# EAGLE board e_book_reader (EAGLE 9.7.0)
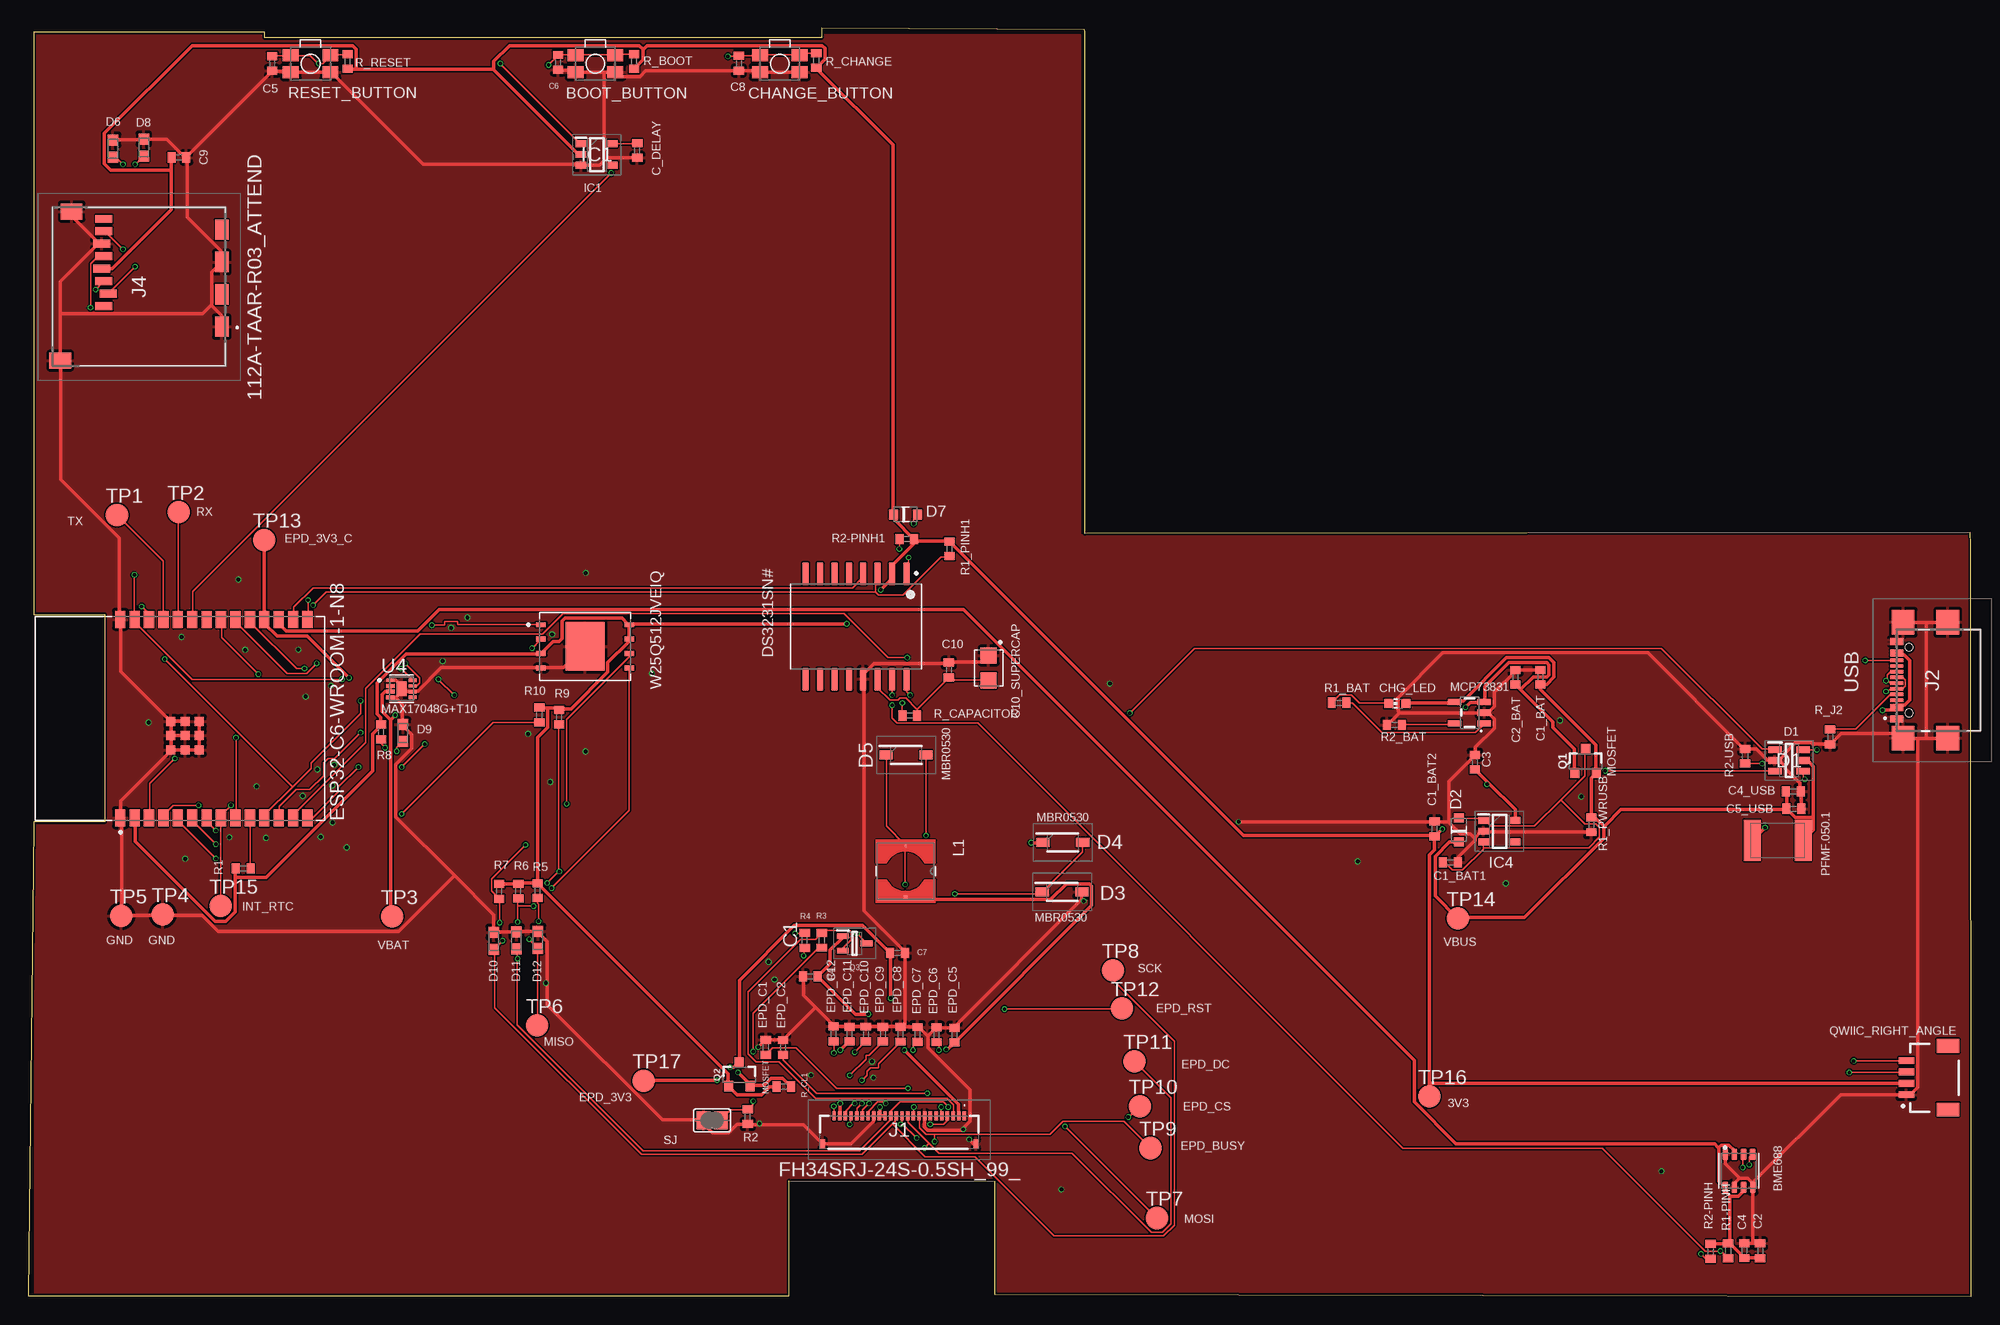
[diagram p1: board, top side]
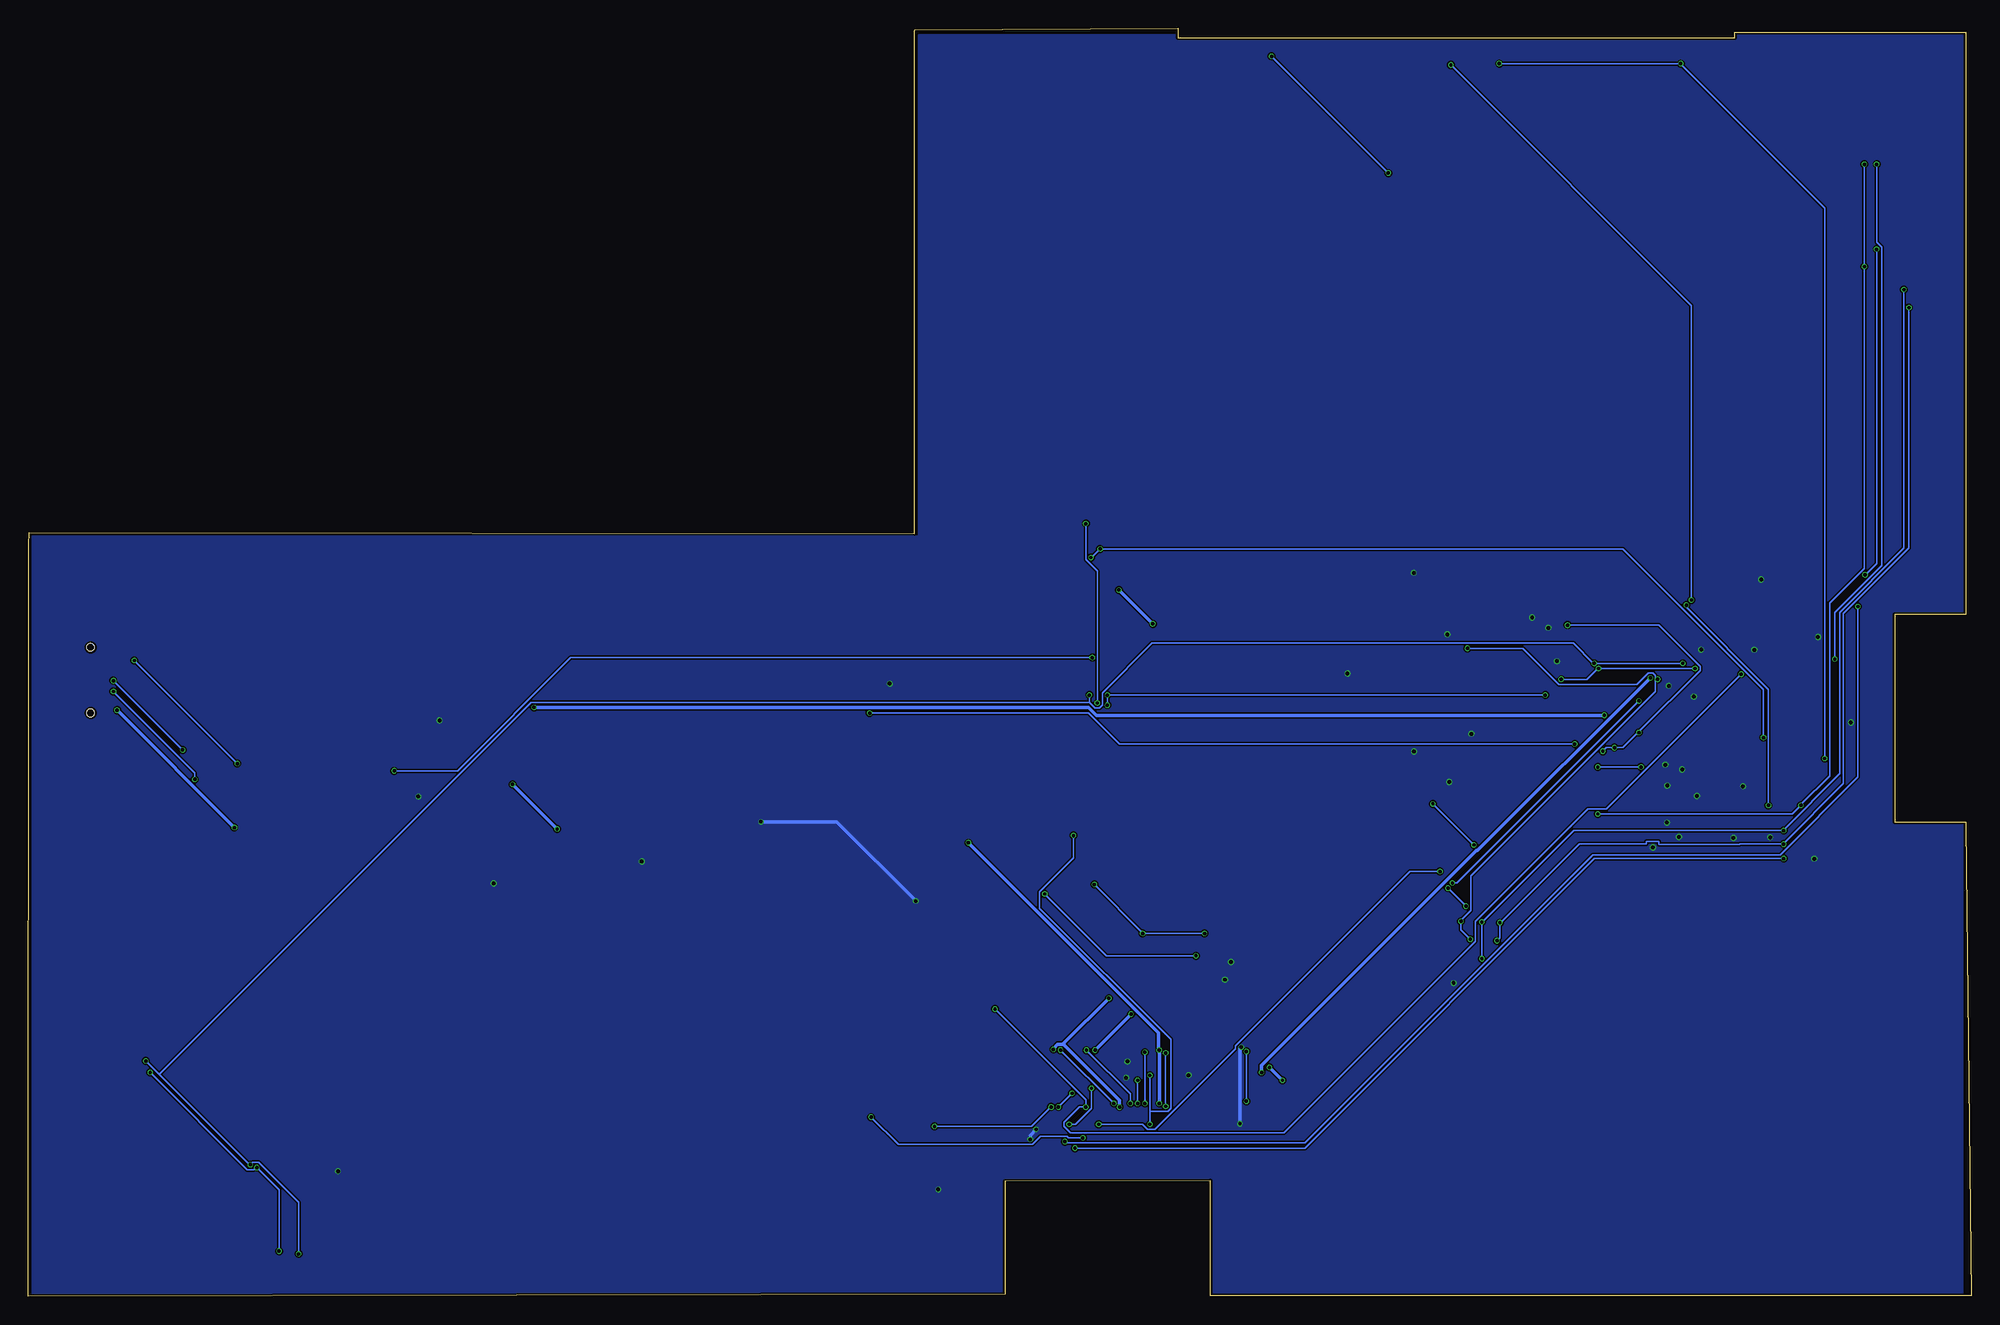
[diagram p2: board, bottom side, seen from below]

Size 171.29 x 111.79 mm. Coordinates in mm from the lower left corner, seen from the top.
Outline: 93.14,111.19 93.14,67.22 171.22,67.32 171.23,66.25 171.29,0 85.2,0.16 85.2,10.14 67.07,10.15 67.07,0.06 0,0.06 0.48,41.53 0.48,41.82 6.74,41.82 6.74,59.94 6.74,59.94 6.74,60.13 0.48,60.12 0.48,111.46 20.82,111.46 20.82,110.97 69.91,110.97 69.93,111.79 93.13,111.66 93.14,111.53 93.14,111.36 93.14,111.36 93.14,111.26 93.14,111.26 93.14,111.19
Outline: 93.14,111.19 93.14,111.19
Copper layers (1*16): Top 0.035mm / dielectric 1.6mm / Bottom 0.035mm
Design rules "jlcpcb-2layers.dru": minimum track width 5mil, minimum drill 0.3mm, track to track 5mil, track to pad 5mil, pad to pad 5mil, via to via 5mil, smd to smd 5mil, copper to edge 0.2mm, drill to drill 6mil, minimum pad ring 10mil, minimum via ring 3mil, stop-mask expansion 4mil, vias tented up to drill 0mil, thermal gap 10mil
Net classes: 1 power_0.3mm: width 0.3 mm; 2 0.15mm: width 0.15 mm

## Footprints (pad centres in the part's own frame; a part is rotated, then mirrored left to right if it is on the bottom)
ESP32_WROVER_EAGLE-LTSPICE_C0402 = smd 0.7 x 0.9: 1 -0.65,0; 2 0.65,0
EAGLE-LTSPICE_C0402 = smd 0.7 x 0.9: 1 -0.65,0; 2 0.65,0
CAPCP3225X100N = smd 1.4 x 1.4: 1 -1.1,0; 2 1.1,0
ADAFRUIT_CHIP-LED0603 = smd 0.8 x 0.8: A 0,-0.75; C 0,0.75
SOT95P280X145-6N = smd 1.2 x 0.6: 1 -1.25,0.95; 2 -1.25,0; 3 -1.25,-0.95; 4 1.25,-0.95; 5 1.25,0; 6 1.25,0.95
ESP32_WROVER_AVX---SD0805S020S1R0_AVX_SD0805S020S1R0_0 = smd 0.8 x 0.9: 1 -1.05,0; 2 1.05,0
SOD3716X135N = smd 1.15 x 0.8: 1 -1.75,0; 2 1.75,0
DIOC1608X36N = smd 0.97 x 0.94: 1 -0.75,0; 2 0.75,0
SOT95P280X125-5N = smd 0.9 x 0.6: 1 -1.4,0.95; 2 -1.4,0; 3 -1.4,-0.95; 4 1.4,-0.95; 5 1.4,0.95
SOT95P280X120-5N = smd 0.9 x 0.6: 1 -1.4,0.95; 2 -1.4,0; 3 -1.4,-0.95; 4 1.4,-0.95; 5 1.4,0.95
FH34SRJ24S05SH99 = smd 0.3 x 0.8: 1 5.75,1.45; 2 5.25,1.45; 3 4.75,1.45; 4 4.25,1.45; 5 3.75,1.45; 6 3.25,1.45; 7 2.75,1.45; 8 2.25,1.45; 9 1.75,1.45; 10 1.25,1.45; 11 0.75,1.45; 12 0.25,1.45; 13 -0.25,1.45; 14 -0.75,1.45; 15 -1.25,1.45; 16 -1.75,1.45; 17 -2.25,1.45; 18 -2.75,1.45; 19 -3.25,1.45; 20 -3.75,1.45; 21 -4.25,1.45; 22 -4.75,1.45; 23 -5.25,1.45; 24 -5.75,1.45 | smd 0.4 x 0.8: MP1 6.75,-1.05; MP2 -6.75,-1.05
SAMACSYS_PARTS_USB4110GFA = smd 0.3 x 1.15: A1 -3.556,3.678; A4 -2.55,3.678; A5 -1.25,3.678; A6 -0.25,3.678; A7 0.25,3.678; A8 1.25,3.678; A9 2.55,3.678; A12 3.556,3.678; B1 3.256,3.678; B4 2.25,3.678; B5 1.75,3.678; B6 0.75,3.678; B7 -0.75,3.678; B8 -1.75,3.678; B9 -2.25,3.678; B12 -3.256,3.678 | smd 2.18 x 2: MP1 -5.11,-0.827; MP2 5.11,-0.827; MP3 -5.11,3.103; MP4 5.11,3.103 | hole 0.65: -2.89,2.603; 2.89,2.603
JST04_1MM_RA = smd 0.6 x 1.35: 1 -1.5,0; 2 -0.5,0; 3 0.5,0; 4 1.5,0 | smd 1.2 x 2: NC1 2.8,-3.675; NC2 -2.8,-3.675
112ATAARR03ATTEND = smd 1.8 x 1.2: G1 10.6,10.4; G2 4.9,10.4; S1 7.75,10.4; S2 2.05,10.4 | smd 1.4 x 1.9: G3 13.6,-3.85; G4 0.45,-2.85 | smd 0.7 x 1.5: P1 8.8,0; P2 7.7,0.4; P3 6.6,0; P4 5.5,-0.2; P5 4.4,0; P6 3.3,-0.2; P7 2.2,0; P8 1.1,0
IND_4828-WE-TPC_WRE = smd 0.254 x 0.152: 1 -2.286,0 | smd 0.305 x 0.305: 2 2.286,0
ESP32_WROVER_SPARKFUN-IC-POWER_SOT23-5 = smd 0.55 x 1.2: 1 -0.95,-1.3; 2 0,-1.3; 3 0.95,-1.3; 4 0.95,1.3; 5 -0.95,1.3
ESP32C6_VARISTOR_CT/CN1812 = smd 1.5 x 3.6: 1 -2.25,0; 2 2.25,0
ESP32_WROVER_SPARKFUN-DISCRETESEMI_SOT23-3 = smd 0.8 x 0.9: 1 -0.95,-1; 2 0.95,-1; 3 0,1.1
SOT65P210X110-3N = smd 1.05 x 0.5: 1 -1.05,0.65; 2 -1.05,-0.65; 3 1.05,0
ESP32_WROVER_EAGLE-LTSPICE_R0402 = smd 0.7 x 0.9: 1 -0.65,0; 2 0.65,0
ESP32_WROVER_BME680_PSON80P300X300X100-8N = smd 1.016 x 0.5: 1 1.458,1.2; 2 1.458,0.4; 3 1.458,-0.4; 4 1.458,-1.2; 5 -1.458,-1.22; 6 -1.458,-0.4; 7 -1.458,0.4; 8 -1.458,1.2
SJ = smd 1.168 x 1.6: 1 -0.762,0; 2 0.762,0
TP20R = smd 2 x 2: TP 0,0
SON127P600X800X80-9N = smd 0.94 x 0.44: 1 -3.895,1.905; 2 -3.895,0.635; 3 -3.895,-0.635; 4 -3.895,-1.905; 5 3.895,-1.905; 6 3.895,-0.635; 7 3.895,0.635; 8 3.895,1.905 | smd 3.4 x 4.3: 9 0,0
XCVR_ESP32-C6-WROOM-1-N8 = smd 1.5 x 0.9: 1 -8.75,5.26; 2 -8.75,3.99; 3 -8.75,2.72; 4 -8.75,1.45; 5 -8.75,0.18; 6 -8.75,-1.09; 7 -8.75,-2.36; 8 -8.75,-3.63; 9 -8.75,-4.9; 10 -8.75,-6.17; 11 -8.75,-7.44; 12 -8.75,-8.71; 13 -8.75,-9.98; 14 -8.75,-11.25; 15 8.75,-11.25; 16 8.75,-9.98; 17 8.75,-8.71; 18 8.75,-7.44; 19 8.75,-6.17; 20 8.75,-4.9; 21 8.75,-3.63; 22 8.75,-2.36; 23 8.75,-1.09; 24 8.75,0.18; 25 8.75,1.45; 26 8.75,2.72; 27 8.75,3.99; 28 8.75,5.26 | smd 0.8 x 0.8: 29_1 -2.755,0.79; 29_2 -1.505,0.79; 29_3 -0.255,0.79; 29_4 -2.755,-0.46; 29_5 -1.505,-0.46; 29_6 -0.255,-0.46; 29_7 -2.755,-1.71; 29_8 -1.505,-1.71; 29_9 -0.255,-1.71
SOIC127P1032X265-16N = smd 2.05 x 0.59: 1 -4.655,4.445; 2 -4.655,3.175; 3 -4.655,1.905; 4 -4.655,0.635; 5 -4.655,-0.635; 6 -4.655,-1.905; 7 -4.655,-3.175; 8 -4.655,-4.445; 9 4.655,-4.445; 10 4.655,-3.175; 11 4.655,-1.905; 12 4.655,-0.635; 13 4.655,0.635; 14 4.655,1.905; 15 4.655,3.175; 16 4.655,4.445
SON50P200X200X80-9N = smd 0.76 x 0.321: 1 -0.985,0.75; 6 0.985,-0.25 | smd 0.813 x 0.401: 2 -0.985,0.25 | smd 0.813 x 0.356: 3 -0.985,-0.25; 4 -0.985,-0.75 | smd 0.76 x 0.27: 5 0.985,-0.75; 7 0.985,0.25; 8 0.985,0.75 | smd 0.9 x 1.3: 9 0,0
MYBUTTON = smd 1.4 x 1.05: 1 1.75,0.75; 2 -1.75,0.75; 3 -1.75,-0.75; 4 1.75,-0.75

## Placement (x,y rotation side)
C1  4.7uF/25V  [ESP32_WROVER_EAGLE-LTSPICE_C0402]  68.45,31.38 90 top
C1_BAT  4.7uF  [ESP32_WROVER_EAGLE-LTSPICE_C0402]  133.3,54.57 90 top
C1_BAT1  4.7uF  [ESP32_WROVER_EAGLE-LTSPICE_C0402]  125.36,38.24 0 top
C1_BAT2  4.7uF  [ESP32_WROVER_EAGLE-LTSPICE_C0402]  123.98,41.2 90 top
C2  100nF  [ESP32_WROVER_EAGLE-LTSPICE_C0402]  152.68,4 90 top
C2_BAT  4.7uF  [ESP32_WROVER_EAGLE-LTSPICE_C0402]  131.11,54.58 90 top
C3  100uF TANT  [ESP32_WROVER_EAGLE-LTSPICE_C0402]  127.53,47.08 90 top
C4  100nF  [ESP32_WROVER_EAGLE-LTSPICE_C0402]  151.3,4.01 90 top
C4_USB  100nF  [ESP32_WROVER_EAGLE-LTSPICE_C0402]  155.61,44.51 0 top
C5  1uF  [EAGLE-LTSPICE_C0402]  21.5,108.69 270 top
C5_USB  4.7uF  [ESP32_WROVER_EAGLE-LTSPICE_C0402]  155.65,42.98 0 top
C6  100nF  [EAGLE-LTSPICE_C0402]  46.69,108.79 270 top
C7  10uF  [ESP32_WROVER_EAGLE-LTSPICE_C0402]  76.64,30.26 0 top
C8  100nF  [ESP32_WROVER_EAGLE-LTSPICE_C0402]  62.64,108.71 270 top
C9  100nF  [ESP32_WROVER_EAGLE-LTSPICE_C0402]  13.28,100.41 0 top
C10  100nF  [ESP32_WROVER_EAGLE-LTSPICE_C0402]  81.15,55.22 90 top
C10_SUPERCAP  CPH3225A  [CAPCP3225X100N]  84.67,55.39 270 top
C_DELAY  100nF  [ESP32_WROVER_EAGLE-LTSPICE_C0402]  53.68,101.02 270 top
CHG_LED  [ADAFRUIT_CHIP-LED0603]  120.69,52.26 90 top
D1  USBLC6-2SC6Y  [SOT95P280X145-6N]  155.23,47.23 0 top
D2  ESP32_WROVER_AVX---SD0805S020S1R0_AVX_SD0805S020S1R0_0_0  [ESP32_WROVER_AVX---SD0805S020S1R0_AVX_SD0805S020S1R0_0]  126.13,41.11 90 top
D3  MBR0530  [SOD3716X135N]  91.14,35.65 0 top
D4  MBR0530  [SOD3716X135N]  91.21,40.01 0 top
D5  MBR0530  [SOD3716X135N]  77.38,47.71 0 top
D6  PGB1010603MR  [DIOC1608X36N]  7.46,101.19 90 top
D7  ESP32_WROVER_AVX---SD0805S020S1R0_AVX_SD0805S020S1R0_0_0  [ESP32_WROVER_AVX---SD0805S020S1R0_AVX_SD0805S020S1R0_0]  77.33,68.93 0 top
D8  PGB1010603MR  [DIOC1608X36N]  10.18,101.29 90 top
D9  PGB1010603MR  [DIOC1608X36N]  33.02,49.66 90 top
D10  PGB1010603MR  [DIOC1608X36N]  41.04,31.34 90 top
D11  PGB1010603MR  [DIOC1608X36N]  43.03,31.37 90 top
D12  PGB1010603MR  [DIOC1608X36N]  44.93,31.42 90 top
EPD_C1  1uF/50V  [ESP32_WROVER_EAGLE-LTSPICE_C0402]  65.02,21.94 90 top
EPD_C2  1uF/50V  [ESP32_WROVER_EAGLE-LTSPICE_C0402]  66.55,21.93 90 top
EPD_C5  0.1uF/50V  [ESP32_WROVER_EAGLE-LTSPICE_C0402]  81.65,23.01 90 top
EPD_C6  1uF/50V  [ESP32_WROVER_EAGLE-LTSPICE_C0402]  80.06,23.05 90 top
EPD_C7  1uF/50V  [ESP32_WROVER_EAGLE-LTSPICE_C0402]  78.4,23.07 90 top
EPD_C8  1uF/50V  [ESP32_WROVER_EAGLE-LTSPICE_C0402]  76.9,23.1 90 top
EPD_C9  1uF/50V  [ESP32_WROVER_EAGLE-LTSPICE_C0402]  75.33,23.1 90 top
EPD_C10  1uF/50V  [ESP32_WROVER_EAGLE-LTSPICE_C0402]  73.84,23.11 90 top
EPD_C11  1uF/50V  [ESP32_WROVER_EAGLE-LTSPICE_C0402]  72.39,23.11 90 top
EPD_C12  1uF/50V  [ESP32_WROVER_EAGLE-LTSPICE_C0402]  70.99,23.12 90 top
IC1  BD5229G-TR  [SOT95P280X125-5N]  50.11,100.66 0 top
IC4  XC6220A331MR-G  [SOT95P280X120-5N]  129.7,40.99 0 top
J1  FH34SRJ-24S-0.5SH_99_  [FH34SRJ24S05SH99]  76.78,14.46 0 top
J2  SAMACSYS_PARTS_USB4110-GF-A  [SAMACSYS_PARTS_USB4110GFA]  168.39,54.31 90 top
J3  QWIIC_RIGHT_ANGLE  [JST04_1MM_RA]  165.58,19.27 90 top
J4  112A-TAAR-R03_ATTEND  [112ATAARR03ATTEND]  6.66,96.09 270 top
L1  68uH  [IND_4828-WE-TPC_WRE]  77.35,37.47 270 top
MCP73831  ESP32_WROVER_SPARKFUN-IC-POWER_MCP73831  [ESP32_WROVER_SPARKFUN-IC-POWER_SOT23-5]  127.06,51.45 90 top
PFMF.050.1  ESP32C6_VARISTORCN1812  [ESP32C6_VARISTOR_CT/CN1812]  154.23,40.19 0 top
Q1  ESP32_WROVER_SPARKFUN-DISCRETESEMI_MOSFET_PCH  [ESP32_WROVER_SPARKFUN-DISCRETESEMI_SOT23-3]  137.29,47.14 0 top
Q2  ESP32_WROVER_SPARKFUN-DISCRETESEMI_MOSFET_PCH  [ESP32_WROVER_SPARKFUN-DISCRETESEMI_SOT23-3]  62.68,19.52 0 top
Q3  SI1308EDL-T1-GE3  [SOT65P210X110-3N]  72.85,31.11 0 top
R1  10k  [ESP32_WROVER_EAGLE-LTSPICE_R0402]  18.94,37.7 0 top
R1-PINH  10K  [ESP32_WROVER_EAGLE-LTSPICE_R0402]  149.86,4 90 top
R1_BAT  200  [ESP32_WROVER_EAGLE-LTSPICE_R0402]  115.56,52.32 0 top
R1_PINH1  10K  [ESP32_WROVER_EAGLE-LTSPICE_R0402]  81.21,65.9 90 top
R1_PWRUSB  100k  [ESP32_WROVER_EAGLE-LTSPICE_R0402]  137.8,41.56 90 top
R2  2.2  [ESP32_WROVER_EAGLE-LTSPICE_R0402]  63.42,15.83 90 top
R2-PINH  10K  [ESP32_WROVER_EAGLE-LTSPICE_R0402]  148.31,3.95 90 top
R2-PINH1  10K  [ESP32_WROVER_EAGLE-LTSPICE_R0402]  77.44,66.75 0 top
R2-USB  5k1  [ESP32_WROVER_EAGLE-LTSPICE_R0402]  151.35,47.62 90 top
R2_BAT  2k  [ESP32_WROVER_EAGLE-LTSPICE_R0402]  120.44,50.38 0 top
R3  0.47  [ESP32_WROVER_EAGLE-LTSPICE_R0402]  69.95,31.38 90 top
R4  10K  [ESP32_WROVER_EAGLE-LTSPICE_R0402]  68.93,28.21 0 top
R5  10K  [ESP32_WROVER_EAGLE-LTSPICE_R0402]  44.9,35.75 90 top
R6  10K  [ESP32_WROVER_EAGLE-LTSPICE_R0402]  43.19,35.71 90 top
R7  10K  [ESP32_WROVER_EAGLE-LTSPICE_R0402]  41.5,35.7 90 top
R8  10K  [ESP32_WROVER_EAGLE-LTSPICE_R0402]  31.1,49.75 90 top
R9  10K  [ESP32_WROVER_EAGLE-LTSPICE_R0402]  46.79,51.04 90 top
R10  10K  [ESP32_WROVER_EAGLE-LTSPICE_R0402]  45.05,51.24 90 top
R_BOOT  10K  [ESP32_WROVER_EAGLE-LTSPICE_R0402]  53.39,108.88 270 top
R_CAPACITOR  15  [ESP32_WROVER_EAGLE-LTSPICE_R0402]  77.7,51.19 0 top
R_CHANGE  10K  [ESP32_WROVER_EAGLE-LTSPICE_R0402]  69.47,108.95 270 top
R_CL1  10K  [ESP32_WROVER_EAGLE-LTSPICE_R0402]  66.61,18.48 180 top
R_J2  5k1  [ESP32_WROVER_EAGLE-LTSPICE_R0402]  158.85,49.31 90 top
R_RESET  10K  [ESP32_WROVER_EAGLE-LTSPICE_R0402]  28.14,108.86 270 top
SENSOR2  BME688  [ESP32_WROVER_BME680_PSON80P300X300X100-8N]  150.81,11.06 90 top
SJ1  [SJ]  60.28,15.49 0 top
TP1  TPTP20R  [TP20R]  7.81,68.88 0 top
TP2  TPTP20R  [TP20R]  13.24,69.12 0 top
TP3  TPTP20R  [TP20R]  32.06,33.47 0 top
TP4  TPTP20R  [TP20R]  11.86,33.65 0 top
TP5  TPTP20R  [TP20R]  8.17,33.53 0 top
TP6  TPTP20R  [TP20R]  44.85,23.86 0 top
TP7  TPTP20R  [TP20R]  99.52,6.89 0 top
TP8  TPTP20R  [TP20R]  95.63,28.73 0 top
TP9  TPTP20R  [TP20R]  98.93,13.06 0 top
TP10  TPTP20R  [TP20R]  98,16.75 0 top
TP11  TPTP20R  [TP20R]  97.52,20.71 0 top
TP12  TPTP20R  [TP20R]  96.41,25.37 0 top
TP13  TPTP20R  [TP20R]  20.77,66.69 0 top
TP14  TPTP20R  [TP20R]  126.02,33.3 0 top
TP15  TPTP20R  [TP20R]  16.94,34.39 0 top
TP16  TPTP20R  [TP20R]  123.51,17.61 0 top
TP17  TP  [TP20R]  54.24,19 0 top
U1  W25Q512JVEIQ  [SON127P600X800X80-9N]  49.09,57.3 0 top
U2  ESP32-C6-WROOM-1-N8  [XCVR_ESP32-C6-WROOM-1-N8]  13.36,50.93 90 top
U3  DS3231SN#  [SOIC127P1032X265-16N]  72.97,59.05 270 top
U4  MAX17048G+T10  [SON50P200X200X80-9N]  32.9,53.55 0 top
U$1  RESET_BUTTON  [MYBUTTON]  24.88,108.68 180 top
U$2  BOOT_BUTTON  [MYBUTTON]  49.99,108.68 180 top
U$3  CHANGE_BUTTON  [MYBUTTON]  66.25,108.68 180 top

## Tracks (layer width: path | path; a pad name or v marks a point on that pad's centre or on a via)
3V3  (via drill 0.3)
  Top 0.3: 18.24,36.93 18.24,33.89 17.42,33.06 16.46,33.06 9.42,40.11 9.42,42.14 U2.2 | 18.24,36.93 18.24,37.69 R1.1 | 18.24,36.93 20.97,36.93 30.37,46.33 30.37,49.57 31.07,50.27 R8.2 31.07,50.46 31.07,51.03 30.75,51.35 30.75,54.08 33.29,56.62 45.17,56.62 U1.3 46.25,57.72 46.81,57.72 47.07,57.99 47.07,59.54 47.33,59.79 52.34,59.79 52.85,59.29 U1.8 | R_CL1.2 65.93,18.45 65.36,18.45 64.66,17.76 62.5,17.76 61.74,18.52 Q2.1 61.68,18.65 61.68,19.6 44.98,36.3 R5.2 | R7.2 41.55,36.36 43.13,36.36 R6.2 43.32,36.42 44.85,36.42 R5.2 | U1.8 52.98,59.16 U1.7 52.91,57.82 52.91,57.7 51.07,55.86 51.07,55.03 47.83,51.79 46.88,51.79 R9.2 46.75,51.73 46.63,51.86 45.8,51.86 | 45.8,51.86 45.1,51.86 R10.2 | 45.8,51.86 45.8,50.14 44.91,49.25 44.91,36.55 R5.2 | 128.76,45.22 127.59,46.39 C3.1 | 128.76,45.22 131.08,42.9 131.08,41.95 IC4.5 | 123.53,18.77 123.53,17.63 TP16.TP | 123.53,18.77 123.53,38.9 123.97,39.35 123.97,40.49 C1_BAT2.1 | 123.53,18.77 165.56,18.77 J3.2 | v128.61,45.12 128.67,45.12 128.76,45.22 | v124.67,41.19 124.1,40.62 C1_BAT2.1 | 12.59,99.29 12.59,95.8 7.38,90.59 6.5,90.59 J4.P4 | 12.59,99.29 12.59,100.37 C9.1 | R2-PINH1.2 78.06,66.78 76.34,68.49 76.34,68.87 D7.1 76.22,69.06 76.22,101.51 69.55,108.18 R_CHANGE.2 69.49,108.31 70.25,109.07 70.25,110.02 69.99,110.28 54.56,110.28 54.31,110.02 54.18,109.96 | R2-PINH1.2 78.19,66.65 78.25,66.59 81.17,66.59 R1_PINH1.2 81.3,66.46 107.14,40.62 123.84,40.62 C1_BAT2.1 | R2-PINH1.2 78.19,66.46 76.15,64.43 76.15,63.73 U3.2 76.09,63.6 76.09,63.22 v75.14,62.27 | 40.98,108.18 28.91,108.18 | 28.91,108.18 28.15,108.18 R_RESET.2
  Top 0.3: 40.98,108.18 48.47,100.69 48.66,100.69 IC1.2 | 54.18,109.96 54.18,109.01 53.42,108.24 R_BOOT.2 | 54.18,109.96 53.87,110.28 42.44,110.28 41.04,108.88 41.04,108.31 40.98,108.18 | 12.59,99.29 7.26,99.29 6.69,99.86 6.69,102.53 14.43,110.28 28.59,110.28 28.91,109.96 28.91,108.18 | v72.15,59.29 53.1,59.29 U1.8
  Bottom 0.3: v124.67,41.19 v128.61,45.12 | v75.14,62.27 v72.15,59.29
32KHZ  (via drill 0.3)
  Top 0.15: v76.79,65.89 76.79,66.71 R2-PINH1.1 | v77.62,65.13 77.62,63.92 77.42,63.73 U3.1 | v18.31,49.25 18.31,42.2 U2.9
  Bottom 0.15: v77.62,65.13 77.55,65.13 v76.79,65.89 30.69,65.89 18.31,53.51 v18.31,49.25
DN  (via drill 0.3)
  Top 0.15: J2.A7 164.74,54.52 165.31,54.52 165.5,54.33 165.5,53.82 165.24,53.57 164.74,53.57 J2.B7 164.67,53.51 164.1,53.51 163.91,53.32 v163.78,53.32 | v156.61,45.57 156.48,45.7 156.48,46.27 D1.4
  Bottom 0.15: v156.61,45.57 156.61,46.14 v163.78,53.32
DP  (via drill 0.3)
  Top 0.15: 163.91,54.33 164.17,54.08 164.67,54.08 J2.A6 | 163.91,54.33 163.91,54.78 164.17,55.03 164.67,55.03 J2.B6 | v157.69,48.17 D1.6 | v163.78,54.27 163.85,54.33 163.91,54.33
  Bottom 0.15: v163.78,54.27 v157.69,48.17
EPD_3V3  (via drill 0.3)
  Top 0.3: v60.72,19.03 54.25,19.03 TP17.TP | v61.87,20.17 62.18,20.17 62.57,20.55 Q2.3 62.69,20.68 62.69,27.85 67.52,32.68 73.55,32.68 75.96,30.27 C7.1 76.03,30.14 v76.03,26.26 | J1.15 75.52,15.91 75.07,15.91 J1.16 75.07,16.04 v75.07,16.68 | L1.2 77.36,35.15 77.55,34.96 90.12,34.96 91.52,36.36 93.55,36.36 93.74,36.17 93.74,34.46 81.68,22.39 EPD_C5.1 81.55,22.26 81.04,21.76 v80.92,21.76
  Bottom 0.3: v61.87,20.17 v60.72,19.03 | v75.07,16.68 75.07,17.25 80.03,22.2 | 80.03,22.2 80.54,22.2 80.92,21.82 v80.92,21.76 | v76.03,26.26 79.96,22.33 80.03,22.2
EPD_3V3_C  (via drill 0.3)
  Top 0.3: R_CL1.1 67.2,18.52 66.5,19.22 65.49,19.22 64.85,18.58 63.64,18.58 Q2.2 63.58,18.71 v62.57,19.72 | TP13.TP 20.78,66.65 20.78,59.73 U2.18 20.85,59.54 20.85,59.29 21.93,58.21 24.59,58.21 v28.28,54.52
  Bottom 0.3: v62.57,19.72 62.57,20.36 43.64,39.28 43.52,39.28 v28.28,54.52
EPD_BUSY  (via drill 0.3)
  Top 0.15: 79.9,14.26 90.06,14.26 91.2,15.41 96.6,15.41 98.89,13.12 TP9.TP | 79.9,14.26 79.14,14.26 78.57,14.84 78.57,15.85 J1.9 | v9.99,60.81 10.62,60.17 10.62,59.73 U2.26 | 79.9,14.26 v79.9,13.63
  Bottom 0.15: v9.99,60.81 9.99,45.76 16.85,38.9 33.36,38.9 58.76,13.5 79.77,13.5 v79.9,13.63
EPD_CS  (via drill 0.3)
  Top 0.15: 77.04,15.22 77.04,15.85 J1.12 | v78.31,13.95 77.04,15.22 | v96.98,15.79 97.93,16.74 TP10.TP | 46.75,37.44 46.75,50.33 R9.1 | v45.74,36.42 46.75,37.44 | 23.29,44.9 20.85,42.46 20.85,42.2 U2.11 | v8.34,99.8 7.7,100.43 7.51,100.43 D6.1 | 23.29,44.9 v12.02,56.17 | v76.92,15.15 76.98,15.22 77.04,15.22 | v46.82,37.44 46.75,37.44 | 23.29,44.9 24.92,46.53 24.92,46.99 29.29,51.36 v29.29,52.49
  Bottom 0.15: v78.31,13.95 79.58,13.95 79.71,14.07 82.06,14.07 82.76,13.37 94.57,13.37 v96.98,15.79 | v45.74,36.42 45.36,36.42 v29.29,52.49 | v8.34,99.8 8.34,92.94 7.89,92.5 7.89,64.43 12.02,60.3 v12.02,56.17 | v76.92,15.15 73.04,15.15 72.6,14.71 71.96,14.71 64.85,21.82 64.85,22.07 49.48,37.44 v46.82,37.44
EPD_DC  (via drill 0.3)
  Top 0.15: 79.42,13.47 80.28,12.61 92.03,12.61 99.01,5.63 99.97,5.63 100.73,6.39 100.73,17.5 97.55,20.68 TP11.TP | 79.42,13.47 77.55,15.34 77.55,15.85 J1.11 | v16.53,38.58 13.23,41.89 13.23,42.14 U2.5 | 79.42,13.47 v79.01,13.06
  Bottom 0.15: v16.53,38.58 33.23,38.58 58.76,13.06 v79.01,13.06
EPD_RST  (via drill 0.3)
  Top 0.15: v78.06,16.68 78.06,15.91 J1.10 | v86.06,25.31 96.41,25.31 TP12.TP | v20.27,54.84 17.04,58.08 17.04,59.67 U2.21
  Bottom 0.15: v86.06,25.31 78.06,17.31 v78.06,16.68 78.63,16.68 79.96,15.34 79.96,14.96 79.39,14.39 60.6,14.39 43.71,31.28 43.71,33.06 33.8,42.97 32.15,42.97 v20.27,54.84
FLASH_CS  (via drill 0.3)
  Top 0.15: v31.45,48.36 31.13,48.68 31.13,49.06 R8.1 | v32.47,48.05 32.47,48.36 32.97,48.87 D9.1 | U2.12 22.12,42.2 22.12,43.16 23.62,44.67 24.81,44.67 26.03,45.89 26.03,47.04 26.41,47.41 27.01,47.41 v29.29,49.7 | v35.58,59.16 36.72,59.16 36.72,59.49 37.83,59.49 37.83,59.21 U1.1
  Bottom 0.15: v32.47,48.05 32.15,48.36 v31.45,48.36 30.69,48.36 29.32,49.73 | v35.58,59.16 27.51,59.16 23.89,55.54 23.89,55.16 29.32,49.73 | v29.29,49.7 29.32,49.73
GDR  (via drill 0.3)
  Top 0.3: v77.23,21.69 82,16.93 82,15.91 J1.2 | v74.06,24.87 72.92,24.87 69.61,28.17 R4.2 69.68,28.3 70.69,29.31 70.69,30.52 71.77,31.6 71.77,31.73 Q3.1
  Bottom 0.3: v74.06,24.87 v77.23,21.69
GND  (via drill 0.3, 0.35)
  Top 0.3: U2.29_1 12.59,48.17 12.59,49.38 U2.29_2 | U2.29_1 12.72,48.17 13.8,48.17 U2.29_4 13.92,48.17 U2.29_7 15.07,48.3 15.07,49.38 U2.29_8 15.07,49.57 15.07,50.65 U2.29_9 | U2.29_3 12.59,50.65 12.59,49.57 U2.29_2 | U2.29_5 13.8,49.44 12.72,49.44 U2.29_2 | U2.29_6 13.8,50.71 12.72,50.71 U2.29_3 | U2.29_1 12.53,48.05 8.15,43.66 8.15,42.2 U2.1 8.21,42.08 8.21,33.69 TP5.TP 8.21,33.57 11.77,33.57 11.83,33.63 TP4.TP 11.96,33.57 15.32,33.57 16.72,32.17 32.66,32.17 37.58,37.09 | U2.29_3 12.46,50.78 8.15,55.09 8.15,59.67 U2.28 8.02,59.79 8.02,66.84 2.88,71.98 2.88,82.4 J4.G3 2.81,82.53 2.81,86.65 | U$3.2 67.96,107.93 64.6,107.93 U$3.1 64.47,107.99 64.41,108.05 62.69,108.05 C8.2 62.5,108.05 54.44,108.05 53.93,107.55 52.15,107.55 51.83,107.86 U$2.2 51.71,107.93 50.75,107.93 | 51.01,100.37 50.37,99.73 48.72,99.73 IC1.3 48.6,99.8 34.82,99.8 26.75,107.86 U$1.2 23.26,107.93 U$1.1 23.13,107.99 21.54,107.99 C5.2 21.42,107.93 13.99,100.5 C9.2 | 51.01,100.37 C_DELAY.2 | C6.2 46.75,108.12 48.09,108.12 48.21,107.99 U$2.1 48.34,107.93 50.75,107.93 | 50.75,107.93 50.75,101.2 50.95,101 50.95,100.5 51.01,100.37 | J4.G4 3.83,95.61 3.83,95.23 6.24,92.81 6.43,92.81 J4.P6 6.11,92.75 2.81,89.45 2.81,86.65 | 16.15,87.35 17.04,86.46 17.04,85.51 J4.G1 | 16.15,87.35 16.15,90.27 17.04,91.16 J4.G2 16.97,91.29 16.97,92.18 13.99,95.16 13.99,100.31 C9.2 | C9.2 13.92,100.43 13.8,100.43 12.21,102.02 10.24,102.02 D8.2 10.11,101.96 7.51,101.96 D6.2 | 2.81,86.65 15.38,86.65 16.02,87.29 16.15,87.35 | 127.53,40.43 127.53,40.17 126.07,38.71 126.07,38.27 C1_BAT1.2 | 127.53,40.43 128.03,40.93 128.29,40.93 IC4.2 128.42,40.93 137.75,40.93 R1_PWRUSB.1
  Top 0.3: 125.18,41.82 124.03,41.82 C1_BAT2.2 123.84,41.82 v106.7,41.82 | 125.18,41.82 126.26,40.74 127.15,40.74 127.4,40.49 127.53,40.43 | C1_BAT.2 133.24,55.22 131.15,55.22 C2_BAT.2 131.08,55.09 129.24,53.25 129.24,51.98 128.8,51.54 MCP73831.2 | MCP73831.2 128.42,51.41 128.73,51.41 129.24,50.9 129.24,50.08 127.59,48.43 127.59,47.79 C3.2 127.46,47.6 125.24,45.38 125.24,41.95 125.18,41.82 | 120.86,51.41 119.84,50.4 R2_BAT.1 | 120.86,51.41 128.22,51.41 MCP73831.2 | 152.04,4.67 152.67,4.67 C2.2 | 152.04,4.67 151.34,4.67 C4.2 | 150.83,10.39 150.45,10.01 150.45,9.63 SENSOR2.7 | 150.83,10.39 151.59,10.39 151.97,10.01 151.97,9.63 SENSOR2.5 | SENSOR2.1 149.62,12.49 149.62,11.66 150.77,10.52 150.83,10.39 | SENSOR2.5 152.1,10.07 159.78,17.76 165.56,17.76 J3.1 165.69,17.82 166.01,17.82 166.58,18.39 166.58,49.19 | 152.04,4.67 152.04,9.5 SENSOR2.5 | J2.B1 164.74,57.57 164.74,57.82 J2.A12 164.74,58.01 164.74,58.9 165.24,59.41 J2.MP4 165.44,59.41 167.34,59.41 | 167.34,59.41 169.18,59.41 J2.MP2 | J2.B12 164.74,51.03 164.74,50.78 J2.A1 164.8,50.65 164.8,49.7 165.24,49.25 J2.MP3 | 166.58,49.19 165.44,49.19 J2.MP3 | 166.58,49.19 167.34,49.19 | 167.34,49.19 169.18,49.19 J2.MP1 | C5_USB.2 156.29,43.03 156.29,44.49 C4_USB.2 156.16,44.62 156.16,45.25 154.89,46.52 154.89,46.71 154.45,47.16 D1.2 | D1.2 153.94,47.28 153.31,47.28 152.35,48.24 151.4,48.24 R2-USB.2 151.21,48.3 142.77,56.75 124.73,56.75 120.73,52.74 120.73,51.73 120.79,51.66 120.79,51.54 120.86,51.41 | D1.2 154.13,47.28 154.39,47.28 154.89,47.79 154.89,47.92 155.78,48.81 157.18,48.81 157.31,48.68 158.83,48.68 R_J2.1 158.96,48.74 159.85,49.63 164.67,49.63 J2.MP3
  Top 0.3: 167.34,49.19 167.34,59.41 | 69.39,25.47 70.95,23.92 EPD_C12.2 71.01,23.79 72.34,23.79 EPD_C11.2 72.54,23.79 73.81,23.79 EPD_C10.2 73.93,23.79 75.33,23.79 EPD_C9.2 75.46,23.79 76.79,23.79 EPD_C8.2 | 69.39,25.47 68.34,26.52 68.34,28.17 R4.1 | 69.39,25.47 66.63,22.71 EPD_C2.2 66.5,22.58 65.04,22.58 EPD_C1.2 64.92,22.52 v64.34,21.95 | C10_SUPERCAP.1 84.09,55.92 81.17,55.92 C10.2 81.04,55.79 74.57,55.79 73.61,54.84 73.61,54.46 U3.13 73.68,54.27 73.68,33.95 77.23,30.39 C7.2 77.3,30.2 77.3,23.85 EPD_C8.2 | 82.38,14.77 83.01,15.41 83.01,18.2 79.33,21.88 79.33,22.96 | 82.38,14.77 82.25,14.64 79.27,14.64 79.01,14.9 79.01,15.85 J1.8 | 79.33,22.96 80.03,23.66 EPD_C6.2 80.15,23.66 81.62,23.66 EPD_C5.2 81.68,23.79 92.85,34.96 | v82.95,13.82 83.33,13.44 83.52,13.44 J1.MP1 | v82.44,14.71 82.38,14.77 | 79.33,22.96 79.2,23.03 78.57,23.66 78.44,23.66 EPD_C7.2 78.25,23.73 76.92,23.73 EPD_C8.2 | 92.85,34.96 92.85,35.6 D3.2 | J1.17 74.5,15.85 74.5,15.41 72.54,13.44 70.06,13.44 J1.MP2 69.93,13.5 68.34,15.09 64.47,15.09 | 64.47,15.09 63.52,15.09 R2.1 63.39,15.15 62.5,15.15 61.74,14.39 60.34,14.39 59.52,15.22 59.52,15.47 SJ1.1 59.39,15.53 55.9,15.53 45.74,25.69 45.74,31.28 44.98,32.04 D12.2 43.13,32.17 D11.2 43.01,32.11 41.1,32.11 D10.2 41.04,32.23 41.04,33.63 37.58,37.09 | U1.9 49.04,57.25 47.2,55.41 45.23,55.41 U1.4 45.04,55.41 36.4,55.41 34.37,53.38 33.99,53.38 U4.6 33.86,53.32 33.23,53.32 33.04,53.51 U4.9 | U4.1 31.96,54.33 32.4,54.33 32.85,53.89 32.85,53.57 U4.9 | 32.4,52.81 31.96,52.81 U4.4 | 32.4,52.81 32.97,53.38 U4.9 | 32.4,52.81 32.47,52.68 32.97,52.17 32.97,50.46 D9.2 33.04,50.27 33.8,49.51 33.8,48.3 32.4,46.9 32.4,42.27 37.58,37.09
  Top 0.3: v64.47,15.22 64.47,15.09 | v93.05,34.84 92.98,34.9 92.85,34.96
  Bottom 0.3: v82.95,13.82 82.95,14.2 v82.44,14.71 | v64.34,21.95 64.47,21.82 v64.47,15.22 | v106.7,41.82 100.03,41.82 v93.05,34.84
  other vias: 49.15,63.78 95.35,54.01 49.11,48.03 44.07,49.59 24.46,52.86 54.98,54.9 10.59,50.58 13.5,58.12 25.77,40.49 26.81,41.75 36.52,55.99 26.66,53.82 74.39,20.69 45.63,27.61 28.07,39.56 117.21,38.33 130.26,36.4 143.99,11.03 136.91,44.05 135.04,50.76 20.12,44.96 13.83,38.57 18.52,63.19 19.13,56.99 23.8,57.01 38.71,59.84 46.18,58.35 91.07,9.41 68.99,19.48 74.5,19.27 65.78,27.91 65.26,29.47 46.02,45.35 37.28,58.93 26.78,45.01 24.18,44.11 25.48,46.44 26.97,46.86 20.95,40.4 17.72,40.46
  pour Top: 67.02,10.23 67.04,10.24 85.21,10.24 85.24,10.23 85.26,10.21 85.27,10.18 85.27,0.08 171.21,0.08 171.21,67.13 92.84,67.13 92.81,67.14 92.79,67.16 92.78,67.19 92.78,111.22 0.62,111.22 0.6,111.22 0.6,111.22 0.6,111.22 0.59,111.22 0.56,111.22 0.56,60.2 6.75,60.2 6.78,60.19 6.8,60.17 6.81,60.14 6.81,41.81 6.8,41.78 6.78,41.76 6.75,41.75 0.56,41.75 0.56,0.14 66.98,0.14 66.98,10.18 66.99,10.21
  pour Bottom: 67,10.25 67.03,10.26 85.26,10.26 85.29,10.25 85.31,10.22 85.32,10.2 85.32,10.17 85.31,10.14 85.31,0.07 170.95,0.07 170.95,67 92.85,67 92.82,67.01 92.8,67.03 92.79,67.06 92.79,111.24 0.69,111.24 0.67,111.24 0.67,111.24 0.67,111.24 0.67,111.24 0.56,111.24 0.56,60.18 6.75,60.18 6.78,60.17 6.8,60.15 6.81,60.12 6.81,41.81 6.8,41.78 6.78,41.76 6.75,41.75 0.75,41.75 0.75,0.13 66.97,0.13 66.97,10.2 66.98,10.22
GPIO8
  Top 0.15: R1.2 19.58,37.76 19.58,42.14 U2.10
I2C_PW
  Top 0.3: C2.1 152.67,3.4 151.34,3.4 C4.1 151.21,3.47 150,4.67 R1-PINH.2 | R2-PINH.2 148.35,4.61 149.81,4.61 R1-PINH.2 | 150.07,8.8 149.62,9.25 149.62,9.56 SENSOR2.8 149.5,9.69 149.05,10.14 149.05,13.12 | 150.07,8.8 150.77,8.8 151.15,9.18 151.15,9.56 SENSOR2.6 | 149.05,13.12 149.24,13.31 149.94,13.31 150.39,12.87 150.39,12.55 SENSOR2.2 | U2.17 22.12,59.67 22.12,59.29 22.75,58.65 34.31,58.65 36.21,60.55 82.44,60.55 122.19,20.8 122.19,17.12 125.87,13.44 148.67,13.44 148.93,13.18 149.05,13.12 | R1-PINH.2 150,4.8 150,8.68 150.07,8.8
INT_RTC  (via drill 0.3)
  Top 0.15: 74.69,62.08 74.95,61.83 77.11,61.83 80.47,65.19 81.17,65.19 R1_PINH1.1 | 74.69,62.08 74.69,63.54 74.82,63.67 U3.3 | TP15.TP 16.97,34.46 16.97,42.14 U2.8 17.04,42.2 17.04,42.46 v17.86,43.28 | 74.69,62.08 26.24,62.08 v25.1,60.94
  Bottom 0.15: v25.1,60.94 25.1,60.75 17.86,53.51 v17.86,43.28
IO/BOOT  (via drill 0.3)
  Top 0.15: R_BOOT.1 53.36,109.51 51.83,109.51 51.77,109.45 U$2.3 51.71,109.45 48.28,109.45 U$2.4 48.21,109.45 46.75,109.45 C6.1 46.69,109.39 v45.87,108.56 | v24.66,61.38 24.66,59.73 U2.15
  Bottom 0.15: v24.66,61.38 24.66,87.35 v45.87,108.56
IO/CHANGE  (via drill 0.3)
  Top 0.15: R_CHANGE.1 69.42,109.58 68.15,109.58 68.03,109.45 U$3.3 67.96,109.45 64.53,109.45 U$3.4 64.47,109.39 62.69,109.39 C8.1 62.63,109.32 v61.68,109.32 | v51.39,99.04 14.5,62.14 14.5,59.73 U2.23
  Bottom 0.15: v61.68,109.32 v51.39,99.04
MISO  (via drill 0.3)
  Top 0.15: v44.98,33.06 44.98,34.58 44.91,34.65 44.91,35.09 R5.1 | v44.15,31.47 44.91,30.71 D12.1 44.91,30.65 44.91,23.92 TP6.TP | v44.4,57.13 45.17,57.89 U1.2 | v27.64,54.4 14.43,54.4 9.42,59.41 9.42,59.67 U2.27 9.35,59.73 v9.35,63.6 | v8.34,92.31 6.81,93.83 6.69,93.83 J4.P7
  Bottom 0.15: v44.15,31.47 44.98,32.3 v44.98,33.06 44.98,33.12 44.09,34.01 44.09,37.06 27.83,53.32 27.83,54.4 | v44.4,57.13 39.52,57.13 36.34,53.95 29.48,53.95 28.47,54.97 28.08,54.97 27.83,54.71 27.83,54.4 | 27.83,54.4 v27.64,54.4 | v8.34,92.31 8.34,64.62 v9.35,63.6
MOSI  (via drill 0.3)
  Top 0.15: 43.07,29.76 43.07,30.58 D11.1 | 43.07,29.76 43.07,23.92 54.18,12.8 73.3,12.8 76.03,15.53 76.03,15.85 J1.14 76.03,15.98 76.03,16.3 76.85,17.12 80.66,17.12 v81.11,16.68 | v43.13,33 43.13,34.39 | 43.13,34.39 43.13,35.03 R6.1 | v43.13,29.76 43.07,29.76 | v46.12,35.98 52.98,42.84 52.98,55.35 U1.5 | 43.13,34.39 v44.53,34.39 | v16.53,41.06 15.77,41.82 15.77,42.14 U2.7 | v5.92,88.75 6.62,89.45 J4.P3 | v91.39,14.96 99.46,6.9 TP7.TP
  Bottom 0.15: v43.13,29.76 v43.13,33 43.07,33 35.01,41.06 v16.53,41.06 16.53,41.12 11.58,46.08 11.58,60.3 5.92,65.95 v5.92,88.75 | v44.53,34.39 v46.12,35.98 | v91.39,14.96 82.82,14.96 v81.11,16.68
N$2
  Top 0.15: R_J2.2 158.9,50.01 161.12,50.01 164.17,53.06 164.67,53.06 J2.A5
N$3
  Top 0.15: R1_BAT.2 116.22,52.3 116.73,52.3 119.33,49.7 127.59,49.7 128.35,50.46 MCP73831.1
N$5  (via drill 0.3)
  Top 0.15: v152.86,46.97 151.4,46.97 R2-USB.1 | v161.94,56.05 164.67,56.05 J2.B5
  Bottom 0.15: v161.94,56.05 v152.86,46.97
N$6
  Top 0.15: 128.29,39.54 128.29,39.98 IC4.3 | 128.29,39.54 128.29,39.41 126.45,37.57 125.56,37.57 124.92,38.2 124.73,38.2 C1_BAT1.1 | D2.2 126.19,42.14 128.1,42.14 IC4.1 128.35,41.89 128.48,41.89 128.92,41.44 132.8,41.44 135.11,43.76 | 135.11,43.76 137.24,45.89 137.24,48.24 Q1.3 | 128.29,39.54 137.56,39.54 138.51,40.49 138.51,41.31 138.19,41.63 137.24,41.63 135.11,43.76
N$7  (via drill 0.3)
  Top 0.15: v68.34,30.01 68.41,30.08 68.41,30.71 C1.1 | v81.68,35.47 89.24,35.47 89.36,35.6 D3.1 89.43,35.66 92.92,39.16 92.92,39.98 D4.2
  Bottom 0.15: v68.34,30.01 76.22,30.01 v81.68,35.47
N$8
  Top 0.15: CHG_LED.C 119.91,52.3 117.37,52.3 116.67,53 115.59,53 114.95,52.36 R1_BAT.1
N$9
  Top 0.15: R2_BAT.2 121.11,50.4 125.68,50.4 125.75,50.46 MCP73831.5
N$11  (via drill 0.3)
  Top 0.15: v79.52,15.15 80.66,15.15 80.98,15.47 80.98,15.85 J1.4 | EPD_C1.1 65.04,21.31 65.61,21.88 67.7,21.88 71.26,18.33 v77.55,18.33
  Bottom 0.15: v79.52,15.15 78.95,15.15 77.55,16.55 v77.55,18.33
N$12  (via drill 0.3)
  Top 0.15: v75.58,16.99 75.46,17.12 74.88,17.12 74.06,16.3 74.06,15.91 J1.18 | v80.28,21.69 80.28,22.2 80.09,22.39 EPD_C6.1
  Bottom 0.15: v80.28,21.69 v75.58,16.99
N$13  (via drill 0.3)
  Top 0.15: v80.47,16.68 80.47,15.91 J1.5 | v79.27,17.88 69.48,17.88 66.55,20.82 EPD_C2.1
  Bottom 0.15: v79.27,17.88 v80.47,16.68
N$14  (via drill 0.3)
  Top 0.15: v74.12,16.99 73.55,16.42 73.55,15.91 J1.19 | v78,21.69 78,22.01 78.38,22.39 EPD_C7.1
  Bottom 0.15: v74.12,16.99 74.12,17.82 v78,21.69
N$15  (via drill 0.3)
  Top 0.15: v73.49,16.99 73.04,16.55 J1.20 | EPD_C8.1 76.9,22.44 74.94,20.48 74.94,20.14 74.26,20.14 73.95,19.82 73.95,19.49 v73.49,19.03
  Bottom 0.15: v73.49,16.99 v73.49,19.03
N$17  (via drill 0.3)
  Top 0.15: v72.85,16.99 72.73,16.99 72.09,16.36 72.09,15.91 J1.22 | v72.85,21.5 73.81,22.46 EPD_C10.1
  Bottom 0.15: v72.85,21.5 v72.85,16.99
N$19  (via drill 0.3)
  Top 0.15: v71.01,16.74 71.01,15.91 J1.24 | v71.01,21.44 71.01,22.46 EPD_C12.1
  Bottom 0.15: v71.01,21.44 v71.01,16.74
N$25
  Top 0.15: IC1.5 51.52,101.64 53.68,101.64 C_DELAY.1
N$39  (via drill 0.3)
  Top 0.15: v77.04,52.3 77.04,51.22 R_CAPACITOR.1 | v78.06,68.11 78.06,68.56 78.38,68.87 D7.2
  Bottom 0.15: v77.04,52.3 77.04,63.92 78.06,64.94 v78.06,68.11
PREVGH  (via drill 0.3)
  Top 0.15: v72.41,15.15 72.47,15.22 72.47,15.85 J1.21 | v79.14,40.62 79.14,47.66 D5.2 | v72.41,19.47 73.83,20.9 73.83,21.25 74.13,21.25 EPD_C9.1
  Bottom 0.15: 72.41,16.3 v72.41,19.47 | 72.41,16.3 v72.41,15.15 | v79.14,40.62 79.14,38.65 82.12,35.66 82.12,34.2 70.57,22.65 70.57,16.55 70.82,16.3 72.41,16.3
PREVGL  (via drill 0.3)
  Top 0.3: v71.58,16.99 71.58,15.91 J1.23 | v71.58,21.69 72.34,22.46 EPD_C11.1 | v88.41,39.98 89.43,39.98 D4.1
  Bottom 0.3: v71.58,16.99 v71.58,21.69 71.65,21.82 71.65,23.22 v88.41,39.98
RESE
  Top 0.15: J1.3 81.55,15.91 81.55,16.87 80.98,17.44 69.42,17.44 66.18,20.68 64.15,20.68 63.45,21.38 63.45,26.84 68.09,31.47 69.42,31.47 69.93,31.98 R3.2 69.99,32.04 70.19,32.23 72.41,32.23 72.54,32.11 72.54,31.41 71.84,30.71 71.84,30.52 Q3.2
RESE'  (via drill 0.3)
  Top 0.15: SJ1.2 61.04,15.53 61.93,16.42 63.39,16.42 R2.2 63.45,16.49 63.9,16.93 v63.9,17.18 | v63.9,21.57 63.9,24.93 69.68,30.71 69.93,30.71 R3.1
  Bottom 0.15: v63.9,17.18 v63.9,21.57
RESET  (via drill 0.3)
  Top 0.15: C5.1 21.54,109.39 23.13,109.39 U$1.4 23.2,109.39 24.85,109.39 25.54,108.69 v25.61,108.69 25.93,108.69 26.62,109.39 U$1.3 26.69,109.45 28.08,109.45 R_RESET.1 | v41.61,108.69 48.66,101.64 IC1.1 | v12.91,47.41 10.69,45.19 10.69,42.2 U2.3
  Bottom 0.15: v41.61,108.69 v25.61,108.69 25.61,108.62 12.91,95.92 v12.91,47.41
RTC_RST
  Top 0.15: U2.16 23.39,59.73 23.39,60.75 25.1,62.46 72.66,62.46 73.55,63.35 73.55,63.67 U3.4
RX
  Top 0.15: U2.24 13.23,59.73 13.23,69.06 TP2.TP
SCK  (via drill 0.3)
  Top 0.15: 76.19,15.18 73.49,12.49 54.06,12.49 41.1,25.44 41.1,30.58 D10.1 41.1,30.65 v41.8,31.35 | 76.19,15.18 76.47,15.47 76.47,15.85 J1.13 | v41.55,32.93 41.55,35.03 R7.1 41.48,35.09 40.85,35.73 40.85,36.81 v43.83,39.79 | v47.45,43.41 47.45,50.84 52.98,56.36 52.98,56.62 U1.6 | v16.53,39.85 14.5,41.89 14.5,42.14 U2.6 | v5.48,87.16 5.48,91.03 6.11,91.67 6.62,91.67 J4.P5 | 76.19,15.18 79.08,12.3 83.46,12.3 90.44,5.31 100.09,5.31 101.05,6.26 101.05,22.46 95.65,27.85 95.65,28.68 TP8.TP
  Bottom 0.15: v41.8,31.35 41.55,31.6 v41.55,32.93 41.48,32.93 34.56,39.85 28.62,39.85 28.62,40.12 27.51,40.12 27.51,39.85 20.39,39.85 v16.53,39.85 16.53,39.92 11.26,45.19 11.26,60.17 5.48,65.95 v5.48,87.16 | v43.83,39.79 v47.45,43.41
SCL  (via drill 0.3)
  Top 0.15: v147.46,3.72 147.85,3.34 148.29,3.34 R2-PINH.1 | v151.72,11.6 151.72,12.23 151.97,12.49 SENSOR2.4 | v160.93,20.74 165.56,20.74 J3.4 | v33.23,55.79 34.5,54.52 34.5,54.08 34.24,53.82 33.93,53.82 U4.7 | v25.42,55.79 24.53,54.9 22.81,54.9 18.31,59.41 18.31,59.67 U2.20 | v77.74,53 77.42,53.32 77.42,54.4 U3.16
  Bottom 0.15: v147.46,3.72 147.46,8.29 150.96,11.79 151.53,11.79 v151.72,11.6 151.78,11.6 159.75,19.57 | 159.75,19.57 v160.93,20.74 | v25.42,55.79 v33.23,55.79 33.29,55.79 35.07,57.57 72.22,57.57 76.6,53.19 76.6,52.11 76.85,51.86 77.23,51.86 77.74,52.36 | 77.74,52.36 v77.74,53 | 159.75,19.57 126.95,52.36 77.74,52.36
SDA  (via drill 0.3)
  Top 0.15: v151.15,11.34 151.15,12.49 SENSOR2.3 | R1-PINH.1 149.81,3.4 149.24,3.98 v149.18,3.98 147.85,3.98 138.77,13.06 121.18,13.06 83.71,50.52 76.6,50.52 76.15,50.97 v76.15,52.11 | v160.55,19.72 165.56,19.72 J3.3 | v32.85,55.35 33.86,54.33 U4.8 | v24.34,55.35 23.64,55.35 19.58,59.41 19.58,59.67 U2.19 | v76.15,53 76.15,54.4 U3.15 | v36.15,54.4 v37.55,53
  Bottom 0.15: v149.18,3.98 149.18,9.37 v151.15,11.34 151.21,11.34 151.4,11.15 151.97,11.15 v160.55,19.72 | v24.34,55.35 v32.85,55.35 32.91,55.35 33.86,54.4 v36.15,54.4 | v37.55,53 v76.15,53 v76.15,52.11
SRC  (via drill 0.3)
  Top 0.15: v67.58,31.98 68.41,31.98 C1.2 | v73.04,31.98 73.87,31.15 Q3.3 | D5.1 75.65,47.66 75.65,41.44 77.3,39.79 L1.1 77.3,39.73 v77.3,36.3
  Bottom 0.15: v67.58,31.98 v73.04,31.98 73.04,32.04 v77.3,36.3
SS_SD  (via drill 0.3)
  Top 0.15: v9.42,99.8 9.48,99.8 10.18,100.5 D8.1 | v9.42,90.78 7.07,88.43 J4.P2 | v32.91,42.52 40.98,50.59 45.04,50.59 R10.1 | v15,43.28 12.78,43.28 11.96,42.46 11.96,42.2 U2.4
  Bottom 0.15: v9.42,99.8 v9.42,90.78 9.42,64.17 12.46,61.13 12.46,45.89 15,43.35 v15,43.28 15.77,42.52 v32.91,42.52
TX
  Top 0.15: U2.25 11.89,59.73 11.89,64.81 7.83,68.87 TP1.TP
USB_D+  (via drill 0.3)
  Top 0.15: v97.11,51.41 102.82,57.13 143.97,57.13 152.86,48.24 153.94,48.24 D1.1 | v32.91,46.65 v34.94,48.68 | v29.1,46.65 27.33,44.88 27.33,44.46 25.05,42.18 U2.14
  Bottom 0.15: v97.11,51.41 77.81,51.41 75.07,48.68 v34.94,48.68 | v29.1,46.65 v32.91,46.65
USB_D-  (via drill 0.3)
  Top 0.15: v139.02,46.33 153.94,46.33 D1.3 | v77.49,56.3 75.77,56.3 71.9,60.17 47.13,60.17 45.36,58.4 34.56,58.4 29.74,53.57 29.74,48.81 23.39,42.46 23.39,42.2 U2.13
  Bottom 0.15: v139.02,46.33 133.43,46.33 123.46,56.3 v77.49,56.3
VBAT  (via drill 0.3)
  Top 0.3: 131.56,53.47 131.15,53.89 C2_BAT.1 | Q1.1 136.29,46.14 136.29,48.25 134.41,50.13 134.41,50.62 131.56,53.47 | 131.56,53.47 132.67,54.59 133.88,54.59 134.07,54.78 134.07,55.67 133.88,55.86 130.51,55.86 128.42,53.76 128.42,52.43 MCP73831.3 128.22,52.36 127.15,52.36 v126.7,51.92 | U4.2 31.9,53.76 31.9,53.32 U4.3 31.77,53.32 31.45,53.32 31.2,53.06 31.2,51.54 31.93,50.81 | 31.93,50.81 31.96,50.78 31.96,33.57 32.02,33.5 TP3.TP | 31.93,50.81 v32.34,51.22
  Bottom 0.3: v126.7,51.92 77.81,51.92 77.11,51.22 v32.34,51.22
VBUS
  Top 0.3: C5_USB.1 155.02,43.03 155.02,44.49 C4_USB.1 | 157.37,42.2 157.37,41.12 156.48,40.23 PFMF.050.1.2 | 157.37,42.2 157.37,46.71 156.86,47.22 156.48,47.22 D1.5 | 157.37,42.2 155.78,42.2 155.09,42.9 C5_USB.1 | D2.1 126.13,40.04 125.3,40.04 124.03,38.77 124.03,35.28 126,33.31 TP14.TP 126.13,33.38 131.91,33.38 138.89,40.36 138.89,41.44 | CHG_LED.A 121.49,52.3 125.68,52.3 125.75,52.36 MCP73831.4 125.87,52.49 126.51,52.49 130.32,56.3 134.07,56.3 134.51,55.86 134.51,54.59 133.88,53.95 133.43,53.95 C1_BAT.1 133.3,53.89 133.3,53.51 138.19,48.62 138.19,46.14 Q1.2 138.13,46.01 137.81,45.7 137.81,42.27 R1_PWRUSB.2 137.94,42.14 138.19,42.14 138.89,41.44 | C5_USB.1 154.89,42.9 140.42,42.9 139.02,41.51 138.89,41.44
VRTC
  Top 0.15: 78.38,51.79 78.38,51.22 R_CAPACITOR.2 | 78.38,51.79 81.11,54.52 C10.1 81.17,54.52 81.36,54.33 84.66,54.33 C10_SUPERCAP.2 | U3.14 74.88,53.63 75.96,52.55 76.66,52.55 76.85,52.74 77.36,52.74 78.31,51.79 78.38,51.79
VUSB  (via drill 0.3)
  Top 0.3: J2.A9 164.74,56.81 164.74,56.62 J2.B4 164.86,56.55 165.37,56.55 165.88,56.05 165.88,52.55 165.44,52.11 164.86,52.11 J2.B9 164.74,52.05 164.74,51.79 J2.A4 164.61,51.66 v163.47,51.66 | v153.12,41.31 152.04,40.23 PFMF.050.1.1
  Bottom 0.3: v153.12,41.31 v163.47,51.66

## Text on the board
tPlace: R_RESET | R_BOOT | R_CHANGE | C5 | C6 | C8 | RESET_BUTTON | BOOT_BUTTON | CHANGE_BUTTON | D6 | D8 | C9 | C_DELAY | IC1 | TX | RX | EPD_3V3_C | R2-PINH1 | R1_PINH1 | C10 | DS3231SN# | R10 | W25Q512JVEIQ | R1_BAT | CHG_LED | MCP73831 | USB | R9 | R_J2 | R_CAPACITOR | C10_SUPERCAP | D9 | R2_BAT | C1_BAT | D1 | C2_BAT | R8 | C3 | MOSFET | R2-USB | C4_USB | C1_BAT2 | C5_USB | R1_PWRUSB | L1 | R1 | R7 | R6 | R5 | IC4 | PFMF.050.1 | C1_BAT1 | INT_RTC | GND | GND | VBUS | VBAT | SCK | D10 | D11 | D12 | EPD_C12 | EPD_C11 | EPD_C10 | EPD_C9 | EPD_C8 | EPD_C7 | EPD_C6 | EPD_C5 | EPD_RST | EPD_C1 | EPD_C2 | QWIIC_RIGHT_ANGLE | MISO | EPD_DC | EPD_3V3 | MOSFET | R_CL1 | EPD_CS | 3V3 | SJ | R2 | EPD_BUSY | BME688 | MOSI | R2-PINH | C4 | C2 | R1-PINH